# Altium schematic sheet All in One.SchDoc: All in One
size A4; Revision: 1; SheetNumber: 2; SheetTotal: 3; SPICEModelCacheWHRBMNBV: <root> / <DocumentId>WHRBMNBV</DocumentId> / <CacheFrame Number="0"> / <Model Name="pmos" Kind="MDL"> / <Text>*Default P-Channel MOSFET / *Pinout: D,G,S / .MODEL PMOS PMOS()</Text> / </Model> / </CacheFrame> / </root>
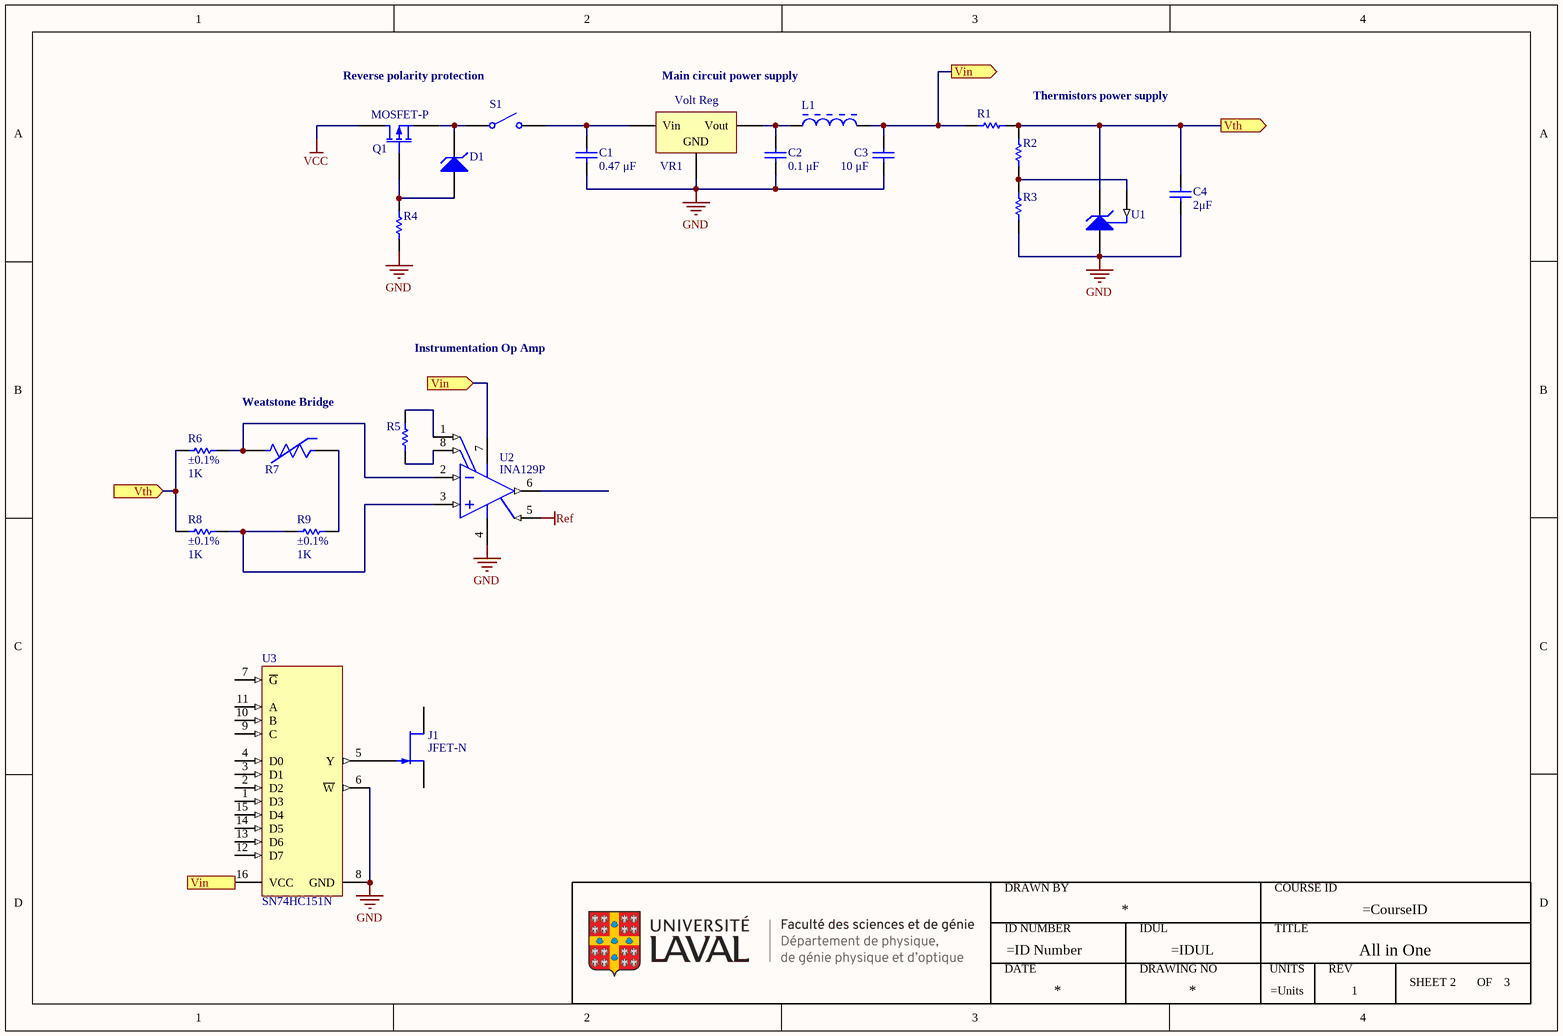
[diagram p0: All in One.SchDoc]

## Parts
*1  ULaval FSG-DPGPO  (value not drawn)
C1  value 0.47 μF  (hidden comment: Capacitor)
C2  value 0.1 μF  (hidden comment: Capacitor)
C3  value 10 μF  (hidden comment: Capacitor)
C4  value 2μF  (hidden comment: Capacitor)
D1  Zener Diode  (value not drawn)
J1  JFET-N
L1  BL01RN1A1D2B  [INDA65-500X360]  (value not drawn)
Q1  MOSFET-P  [E3]
R1  Resistor  (value not drawn)
R2  Resistor  (value not drawn)
R3  Resistor  (value not drawn)
R4  Resistor  (value not drawn)
R5  Resistor  (value not drawn)
R6  value 1K  TC: ±0.1%  (hidden comment: Resistor)
R7  TMP6131DYAT  [FP-DYA0002A-MFG]  (value not drawn)
R8  value 1K  TC: ±0.1%  (hidden comment: Resistor)
R9  value 1K  TC: ±0.1%  (hidden comment: Resistor)
S1  Single-Pole, Single-Throw Switch  (value not drawn)
U1  TL431AILPR  [LP0003A]  (value not drawn)
U2  INA129P  [P0008A]
U3  SN74HC151N  [N0016A]
VR1  Volt Reg  [D2PAK_N]

## Ports
Vin (in, see All in One[1D], All in One[3A]), Vin (in, see All in One[2B], All in One[3A]), Vin (out, see All in One[1D], All in One[2B]), Vth (in, see All in One[4A]), Vth (out, see All in One[1B])

## Nets
GND: C1.1 C2.1 C3.1 C4.1 R3.1 R4.1 U1.2(ANODE) U2.4(V-) U3.6(~{W}) U3.8(GND) VR1.2(GND)
Ref: U2.5(REF)
VCC: Q1.1(D)
Vin: C3.2 L1.2 R1.2 U2.7(V+) U3.16(VCC) ; port Vin
Vth: C4.2 R1.1 R2.2 R6.2 R8.2 U1.3(CATHODE) ; port Vth
NetC1_2: C1.2 S1.2 VR1.1(Vin)
NetC2_2: C2.2 L1.1 VR1.3(Vout)
NetD1_1: D1.1(A) Q1.2(G) R4.2
NetD1_2: D1.2(K) Q1.3(S) S1.1
NetJ1_2: J1.2(G) U3.5(Y)
NetR2_1: R2.1 R3.2 U1.1(REF)
NetR5_1: R5.1 U2.8(RG)
NetR5_2: R5.2 U2.1(RG)
NetR6_1: R6.1 R7.1(-) U2.2(VIN-)
NetR7_2: R7.2(+) R9.1
NetR8_1: R8.1 R9.2 U2.3(VIN+)

Not connected (* = marked no-connect by the designer): J1 1(D) 3(S); U2 6(VO); U3 1(D3) 2(D2) 3(D1) 4(D0) 7(~{G}) 9(C) 10(B) 11(A) 12(D7) 13(D6) 14(D5) 15(D4)

## Notes on the sheet
- Reverse polarity protection
- Main circuit power supply
- Thermistors power supply
- Instrumentation Op Amp
- Weatstone Bridge
- (in symbol ULaval FSG-DPGPO) DRAWN BY; COURSE ID; ID NUMBER; IDUL; TITLE; DATE; DRAWING NO; UNITS; REV; SHEET; OF

## Library data of the parts
C1-C4 = Capacitor: SimulationGenericComponent: True
D1 = Zener Diode: AF: 1; BV_MAX: 1e99; CJO: 0; EG: 1.11; FC: 0.5; IBV: 0.001; IS: 1e-14; MJSW: 0.33; NTUN: 30; TNOM: 27; XTI: 3; SimulationGenericComponent: True; BV: 100; CJP: 0; CTA: 0; CTP: 0; FCS: 0.5; FV_MAX: 1e99; IKF: 0; IKR: 0; ISR: 1e-14; JSW: 0; JTUN: 0; JTUNSW: 0; KEG: 1; KF: 0; LEVEL: 1; N: 1; NBV: 1; NR: 1; NS: 1; PHP: 1; RS: 0; TCV: 0; TLEV: 0; TLEVC: 0; TM1: 0; TM2: 0; TPB: 0; TPHP: 0; TRS: 0; TRS2: 0; TT: 0; TTT1: 0; TTT2: 0; VJ: 1; XTITUN: 3
J1 = JFET N-ch Level1: N-channel Junction gate Field-Effect Transistor Level1; AF: 1; BETA: 0.0001; BEX: 0; FC: 0.5; IS: 1e-14; NLEV: 2; TNOM: 27; VT0: -2; SimulationGenericComponent: True; B: 1; CGD: 0; CGS: 0; GDSNOI: 1; KF: 0; LAMBDA: 0; PB: 1; RD: 0; RS: 0; TCV: 0
L1 = CMP-006-00003-3: EMI Suppression Filter (Lead Type EMIFIL(R)), 7 A, -40 to 85 degC, 2-Pin THD, RoHS, Bulk; Manufacturer: Murata; Impedance: 50Ohm; Current Rating: 7A; Core Material: Ferrite; Packaging: Bulk; Package Reference: INDA65-500X360; Case/Package: Axial; Datasheet URL: http://www.murata.com/en-us/products/productdata/8796738977822/ENFA0005.pdf; Package Quantity: 500; Diameter: 3.6mm; Datasheet Version: May-16; Min Operating Temperature: -40°C; Mounting Technology: TH; RoHS Compliant: True; Package Description: 2-Pin Axial Lead, Dia 3.6 mm, Body Length 5 mm; Max Operating Temperature: 85°C; Pins: 2; Max Current Rating: 7A
Q1 = MOSFET-P: P-Channel MOSFET; Published: 8-Jun-2000; LatestRevisionDate: 17-Jul-2002; LatestRevisionNote: Re-released for DXP Platform.; PackageVersion: 1995/1996; PackageReference: E3; Publisher: Altium Limited; PackageDescription: TO, Flat Index; 3 In-Line, Axial Leads; Body Dia. 4.6mm; Lead Dia. 0.5 mm (max)
R1-R5 = Resistor: TC1: 0; SimulationGenericComponent: True; Value: 1K; TC2: 0
R6 R8 R9 = Resistor: TC1: 0; SimulationGenericComponent: True; TC2: 0
R7 = CMP-009-00177-1: ±1% tolerance 10kΩ linear thermistor available in 0402 and 0603 package options 2-SOT-5X3 -40 to 125; Max Operating Temperature: 125°C; Mounting Technology: Surface Mount; Min Operating Temperature: -40°C; Series: -; Resistance Tolerance: 1%
S1 = SPST SW: closed: 0; Rclosed: 1m; Ropen: 1Meg; SimulationGenericComponent: True
U1 = CMP-019-00054-1: IC VREF SHUNT ADJ TO92-3; Max Output Voltage: 36V; Cathode Current: 700uA; Max Output current: 100mA; Min Input Voltage: 2.495V; Temperature Coefficient: 92ppm/°C; Max Supply Voltage: 37V; Reference Type: Shunt,Adjustable; Tolerance: 1%; Number of Channels: 1; Max Operating Temperature: 125°C; Reach SVHC Compliant: Yes; Weight: 0.00752oz; Case/Package: TO-92-3; RoHS Compliant: Yes; Packaging: Tape and Reel; Lead Free: Lead Free; Package Quantity: 1; Output Voltage: 36V; Output Current: 100mA; Series: -; Reference Voltage: 36V; Min Operating Temperature: -40°C; Pins: 3
U2 = CMP-014-00009-1: Precision, Low Power Instrumentation Amplifiers 8-PDIP; Common Mode Rejection Ratio: 120dB; Supply Current: 750uA; -3db Bandwidth: 1.3MHz; Input Bias Current: 5nA; Output Current per Channel: 15mA; Number of Channels: 1; Input Voltage Noise Density: 8nV/sqrt Hz; Input Resistance: 100GR; Voltage Gain: 80dB; Number of Elements: 3; Dual Supply Voltage: 15V; Slew Rate: 4V/µs; Min Dual Supply Voltage: 2.25V; Max Dual Supply Voltage: 18V; Operating Supply Current: 700uA; Min Supply Voltage: 4.5V; Input Offset Voltage (Vos): 50uV; Max Supply Voltage: 36V; RoHS Compliant: Yes; Min Operating Temperature: -40°C; Gain Bandwidth Product: 1.3MHz; Weight: 0.018646oz; Length: 9.81mm; Width: 6.35mm; Series: INA129; Pins: 8; Max Operating Temperature: 125°C; Number of Amplifiers: 1; Nominal Supply Current: 750uA; Packaging: Rail/Tube; Bandwidth: 1.3MHz; Height: 4.57mm; Case/Package: P; Lead Free: Lead Free; Quiescent Current: 700uA; Reach SVHC Compliant: Yes; Package Quantity: 50; Number of Circuits: 1; Radiation Hardening: No
U3 = CMP-016-00010-1: Multiplexer 1-Element CMOS 8-IN 16-Pin PDIP Tube / IC 8-TO-1 DATA SEL/MUX 16-DIP; Max Supply Voltage: 6V; Propagation Delay: 47ns; Independent Circuits: 1; Number of Input Lines: 8; Operating Supply Voltage: 5V; Bandwidth: 28MHz; Low Level Output Current: 7.8mA; Supply Type: Single; Min Supply Voltage: 2V; Polarity: Non-Inverting; Lead Free: Lead Free; Logic Function: Multiplexer; Height: 4.57mm; Radiation Hardening: No; Pins: 16; Number of Channels: 1; Number of Circuits: 1; Number of Inputs: 8; Number of Output Lines: 1; Weight: 0.03357oz; Mounting Technology: Through Hole; Package Quantity: 25; Min Operating Temperature: -40°C; Number of Bits: 8; Number of Outputs: 1; RoHS Compliant: Yes; Max Operating Temperature: 85°C; Series: 74HC; Width: 6.35mm; Reach SVHC Compliant: Yes; High Level Output Current: 7.8mA; Case/Package: PDIP; Packaging: Rail/Tube; Length: 19.3mm
VR1 = Volt Reg: Voltage Regulator; Published: 24-Mar-1999; LatestRevisionDate: 29-May-2009; LatestRevisionNote: IPC-7351 Footprint Added.; PackageReference: D2PAK; Publisher: Altium Limited; PackageDescription: 3-Pin Transistor Outline Package 2.54 mm Pitch, 15.1 mm Lead Span